# Altium schematic sheet 24-Power-P3V3_P1V8DPLL.SchDoc
size B; SheetNumber: 24; SheetTotal: 25; SPICEModelCacheMBQUAUON: <root> / <DocumentId>MBQUAUON</DocumentId> / <CacheFrame Number="0"> / <Model Name="emk105bj105_v-f" Kind="CKT"> / <Text>* EMK105BJ105_V-F     SPICE MODEL  ( General Type ) / *-------------------------------------------------------------------------------------------------------- / * Model Generated by TAIYO YUDEN Corporation (http://www.ty-top.com) / * Version 1.0 / * TAIYO YUDEN Control No. 170508_130520 / * Copyright(c) 2012 TAIYO YUDEN CO.,LTD. All Rights Reserved. / *-------------------------------------------------------------------------------------------------------- / * / * Products Name : Multilayer Ceramic Capacitors / * / * Characteristics : / *     Capacitance : 1 uF , Rated Voltage : 16V , TCC : X5R / *     Case Size : 1.0 x 0.5 / 0.039 x 0.02 [mm/inch] , Thickness : 0.5 / 0.02 [mm/inch] / *     (Conditions: Temperature = 25 degC , DC Bias Current/Voltage = 0A / 0V) / * / * Frequency Range : 40Hz - 3GHz / * / * External Node Assignments : / * / *  1  o---| |---o  2 / * / *-------------------------------------------------------------------------------------------------------- / .SubCkt EMK105BJ105_V-F 1 2 / **************************** / C0 1 110 0.68309u / Cm 1 101 0.26053u / C1 101 102 0.94076u / Rc1 101 102 1.9029k / C2 102 103 0.66707u / Rc2 102 103 120.36 / C3 103 110 0.57203u / Rc3 103 110 2.1097 / C2m 1 301 0.1871u / C21 301 302 3.2494u / Rc21 301 302 1.1117k / C22 302 303 2.1014u / Rc22 302 303 1.484k / C23 303 304 2.1172u / Rc23 303 304 1.3876k / C24 304 305 0.75729u / Rc24 304 305 332.59 / C25 305 306 0.94401u / Rc25 305 306 249.09 / C26 306 307 0.34674u / Rc26 306 307 28.352 / C27 307 308 0.37158u / Rc27 307 308 19.989 / C28 308 309 0.17933u / Rc28 308 309 31.748 / C29 309 110 0.016445u / Rc29 309 110 1.0592 / Rp0 1 110 100Meg / L0 110 120 0.2216n / Lm 120 130 0.1509n / L1 120 121 0.12659n / RL1 121 130 0.85161 / L2 120 122 0.15996n / RL2 122 130 0.42469 / L3 120 123 7.9543n / RL3 123 130 0.54643m / CR 120 124 0.24334u / LR 124 125 0.090738n / RR 125 130 68.076m / CL 130 140 2.7354p / LL 130 140 0.10762n / RL 130 140 50.614 / Rs 140 2 7.5416m / **************************** / .ends EMK105BJ105_V-F</Text> / </Model> / </CacheFrame> / </root>
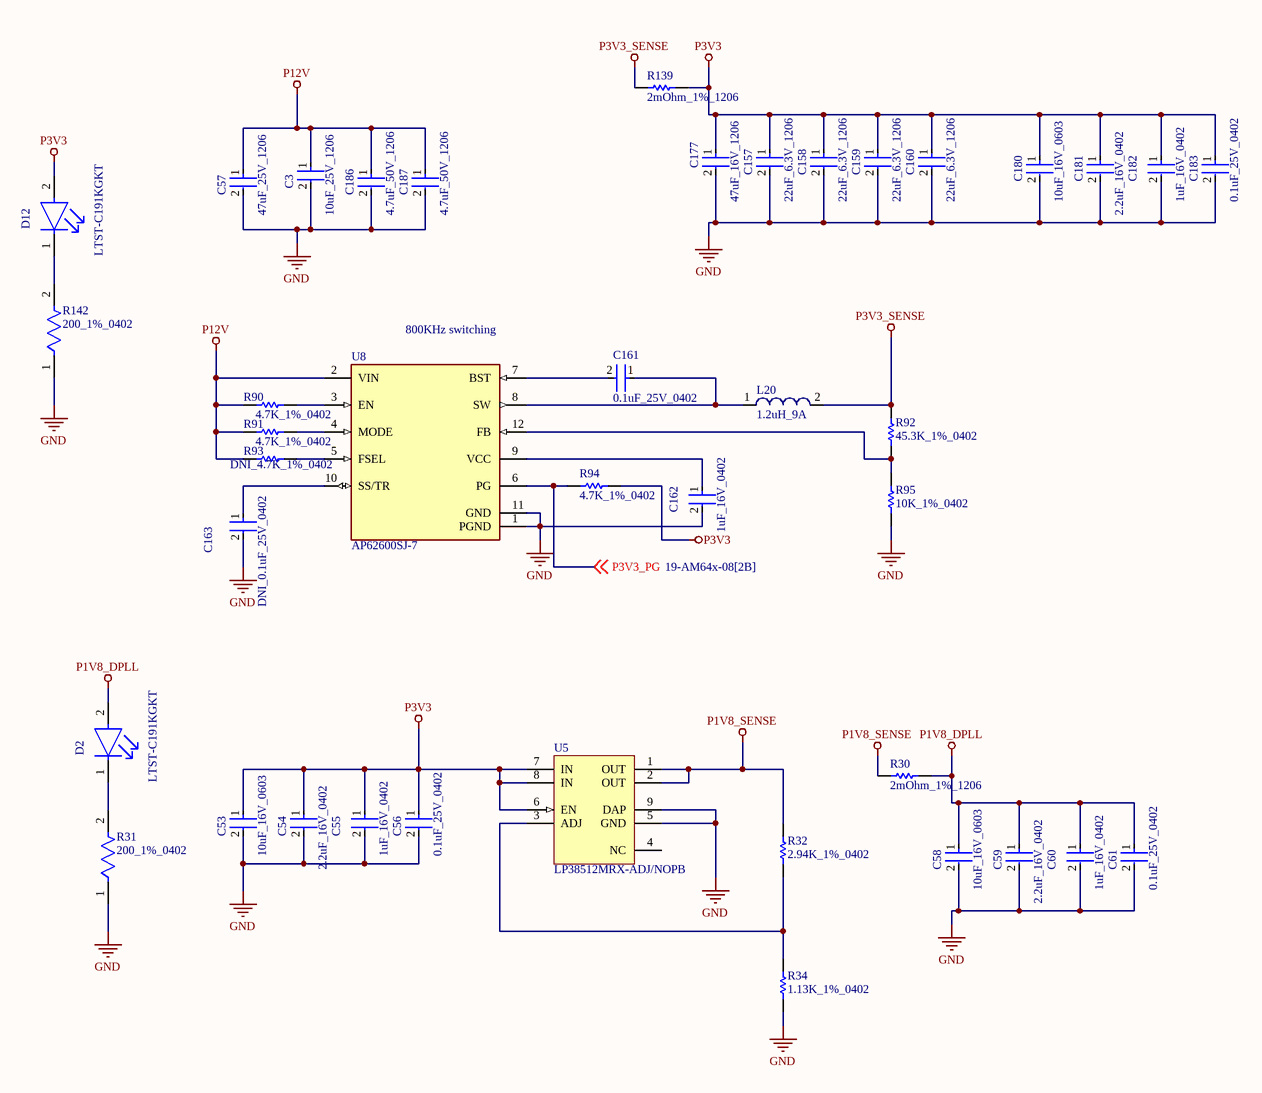
[diagram p0: 24-Power-P3V3_P1V8DPLL.SchDoc]

## Parts
C3  10uF_25V_1206  [FP-1206-L_3_2_0_2-W_1_6_0-IPC_A]
C53  10uF_16V_0603  [FP-0603-L_1_6_0_2-W_0_8_0-MFG]
C54  2.2uF_16V_0402  [FP-C1005-050-0_05-IPC_A]
C55  1uF_16V_0402  [FP-0402-L_1_0_0_05-W_0_5-IPC_A]
C56  0.1uF_25V_0402  [FP-0402-L_1_0_1-W_0_5_0_1-IPC_C]
C57  47uF_25V_1206  [FP-C3216-160-0_2-MFG]
C58  10uF_16V_0603  [FP-0603-L_1_6_0_2-W_0_8_0-MFG]
C59  2.2uF_16V_0402  [FP-C1005-050-0_05-IPC_A]
C60  1uF_16V_0402  [FP-0402-L_1_0_0_05-W_0_5-IPC_A]
C61  0.1uF_25V_0402  [FP-0402-L_1_0_1-W_0_5_0_1-IPC_C]
C157  22uF_6.3V_1206  [FP-1206-L_3_2_0_2-W_1_6_0-IPC_C]
C158  22uF_6.3V_1206  [FP-1206-L_3_2_0_2-W_1_6_0-IPC_C]
C159  22uF_6.3V_1206  [FP-1206-L_3_2_0_2-W_1_6_0-IPC_C]
C160  22uF_6.3V_1206  [FP-1206-L_3_2_0_2-W_1_6_0-IPC_C]
C161  0.1uF_25V_0402  [FP-0402-L_1_0_1-W_0_5_0_1-IPC_C]
C162  1uF_16V_0402  [FP-0402-L_1_0_0_05-W_0_5-IPC_A]
C163  DNI_0.1uF_25V_0402  [FP-0402-L_1_0_1-W_0_5_0_1-IPC_C]  (no BOM)
C177  47uF_16V_1206  [FP-C3216-160-0_2-MFG]
C180  10uF_16V_0603  [FP-0603-L_1_6_0_2-W_0_8_0-MFG]
C181  2.2uF_16V_0402  [FP-C1005-050-0_05-IPC_A]
C182  1uF_16V_0402  [FP-0402-L_1_0_0_05-W_0_5-IPC_A]
C183  0.1uF_25V_0402  [FP-0402-L_1_0_1-W_0_5_0_1-IPC_C]
C186  4.7uF_50V_1206  [FP-GRM31C-0_2-e0_3_0_8-IPC_C]
C187  4.7uF_50V_1206  [FP-GRM31C-0_2-e0_3_0_8-IPC_C]
D2  LTST-C191KGKT  [FP-LTST-C191KGKT-MFG]
D12  LTST-C191KGKT  [FP-LTST-C191KGKT-MFG]
L20  1.2uH_9A  [WE-LHMI 7050]
R30  2mOhm_1%_1206  [RESC3216X89X64NL25T25]
R31  200_1%_0402  [FP-ERJ2RK-IPC_A]
R32  2.94K_1%_0402  [RESC1005X40X25ML05T10]
R34  1.13K_1%_0402  [RESC1005X40X25NL05T05]
R90  4.7K_1%_0402  [RESC1005X40X25NL10T10]
R91  4.7K_1%_0402  [RESC1005X40X25NL10T10]
R92  45.3K_1%_0402  [RESC1005X40X25ML05T10]
R93  DNI_4.7K_1%_0402  [RESC1005X40X25NL10T10]  (no BOM)
R94  4.7K_1%_0402  [RESC1005X40X25NL10T10]
R95  10K_1%_0402  [RESC1005X40X25NL10T10]
R139  2mOhm_1%_1206  [RESC3216X89X64NL25T25]
R142  200_1%_0402  [FP-ERJ2RK-IPC_A]
U5  LP38512MRX-ADJ/NOPB  [MRA08B_M]
U8  AP62600SJ-7  [FP-V-QFN2030-12_Type_A-MFG]

## Nets
GND: C3.2 C53.2 C54.2 C55.2 C56.2 C57.2 C58.2 C59.2 C60.2 C61.2 C157.2 C158.2 C159.2 C160.2 C162.2 C163.2 C177.2 C180.2 C181.2 C182.2 C183.2 C186.2 C187.2 R31.1 R34.1 R95.1 R142.1 U5.5(GND) U5.9(DAP) U8.1(PGND) U8.11(GND)
P1V8_DPLL: C58.1 C59.1 C60.1 C61.1 D2.2(A) R30.2
P1V8_SENSE: R30.1 R32.2 U5.1(OUT) U5.2(OUT)
P3V3: C53.1 C54.1 C55.1 C56.1 C157.1 C158.1 C159.1 C160.1 C177.1 C180.1 C181.1 C182.1 C183.1 D12.2(A) R94.1 R139.2 U5.6(EN) U5.7(IN) U5.8(IN)
P3V3_SENSE: L20.2 R92.2 R139.1
P12V: C3.1 C57.1 C186.1 C187.1 R90.1 R91.1 R93.1 U8.2(VIN)
P3V3_PG: R94.2 U8.6(PG) ; off-sheet P3V3_PG
NetC161_1: C161.1 L20.1 U8.8(SW)
NetC161_2: C161.2 U8.7(BST)
NetC162_1: C162.1 U8.9(VCC)
NetC163_1: C163.1 U8.10(SS/TR)
NetD2_1: D2.1(C) R31.2
NetD12_1: D12.1(C) R142.2
NetR32_1: R32.1 R34.2 U5.3(ADJ)
NetR90_2: R90.2 U8.3(EN)
NetR91_2: R91.2 U8.4(MODE)
NetR92_1: R92.1 R95.2 U8.12(FB)
NetR93_2: R93.2 U8.5(FSEL)

Not connected (* = marked no-connect by the designer): U5 4(NC)

## Notes on the sheet
- (near U8) 800KHz switching

## Library data of the parts
C3 = CMP-04427-006943-1: General Purpose Ceramic Capacitor, 1206, 10uF, 20%, X5R, 15%, 25V; Dissipation Factor: 12.5%; Insulation Resistance: 10GR; Case Code (Imperial): 1206; Series: -; Construction: Flat; Termination: SMD/SMT; Case/Package: 1206; Dielectric: X5R; Width: 1.6mm; Max Operating Temperature: 85°C; Height: 0.07mm; Package Quantity: 1; Depth: 1.6mm; Voltage Rating: 25V; Capacitance: 10uF; RoHS Compliant: Yes; Mount: Surface Mount; Radiation Hardening: No; Voltage Rating (DC): 25V; Number of Pins: 2; Contact Plating: Tin; Min Operating Temperature: -55°C; Lead Free: Lead Free; Packaging: Tape and Reel; Tolerance: 20%; Case Code (Metric): 3216; Thickness: 0.07inch; Length: 3.2mm; REACH SVHC: No SVHC
C53 C58 C180 = CMP-2000-06226-4: Multilayer Ceramic Capacitor 10uF 16V X5R 20% SMD 0603 T/R; Packaging: Tape and Reel; Construction: Flat; Height: 0.8mm; Max Operating Temperature: 85°C; Dielectric: X5R; Case Code (Metric): 1608; Voltage Rating (DC): 16V; Width: 0.031inch; Voltage Rating: 16V; Length: 0.063inch; RoHS Compliant: Yes; Halogen Free: Halogen Free; Case Code (Imperial): 0603; Capacitance: 10uF; Mount: Surface Mount; Thickness: 0.031inch; Tolerance: 20%; Min Operating Temperature: -55°C; Series: M; Termination: SMD/SMT; Case/Package: 0603; Package Quantity: 1
C54 C59 C181 = CMP-2000-05998-2: Multilayer Ceramic Capacitors 2.2μF ±10% 16V X5R SMD 0402; Capacitance: 2.2uF; REACH SVHC: No SVHC; Series: C; Termination: SMD/SMT; Case Code (Imperial): 0402; Depth: 0.5mm; Mount: Surface Mount; Width: 0.02inch; Package Quantity: 1; Dielectric Material: Ceramic; Length: 1mm; Packaging: Tape and Reel; Case Code (Metric): 1005; RoHS Compliant: Yes; Dielectric: X5R; Max Operating Temperature: 85°C; Lead Free: Lead Free; Weight: 2.3E-05oz; Thickness: 0.022inch; Voltage Rating (DC): 16V; Tolerance: 10%; Voltage Rating: 16V; Resistor Type: Ceramic; Height: 0.5mm; Case/Package: 0402; Min Operating Temperature: -55°C
C55 C60 C162 C182 = CMP-14477-000104-2: None; Tolerance: 10%; Voltage Rating: 16V; Dielectric: X5R; Capacitance: 1uF; Packaging: Tape and Reel; Depth: 0.5mm; Mount: Surface Mount; Thickness: 0.022inch; Package Quantity: 1; Min Operating Temperature: -55°C; Series: M; Voltage Rating (DC): 16V; Termination: SMD/SMT; Case/Package: 0402; Number of Pins: 2; Case Code (Imperial): 0402; Length: 1mm; Halogen Free: Halogen Free; Case Code (Metric): 1005; Width: 0.02inch; RoHS Compliant: Yes; Radiation Hardening: No; Max Operating Temperature: 85°C; Height: 0.5mm; Construction: Flat
C56 C61 C161 C163 C183 = CMP-2008-02519-2: General Purpose Ceramic Capacitor, 0402, 100nF, 10%, X7R, 15%, 25V; Package Quantity: 1; Capacitance: 100nF; Min Operating Temperature: -55°C; Voltage: 25V; Voltage Rating: 25V; Construction: Flat; Max Operating Temperature: 125°C; Radiation Hardening: No; Depth: 0.5mm; Thickness: 0.022inch; Voltage Rating (DC): 25V; Number of Pins: 2; Lead Free: Lead Free; Series: -; REACH SVHC: No SVHC; Length: 1mm; Dielectric: X7R; RoHS Compliant: Yes; Mount: Surface Mount; Packaging: Tape and Reel; Case/Package: 0402; Case Code (Imperial): 0402; Termination: SMD/SMT; Width: 0.02inch; Case Code (Metric): 1005; Tolerance: 10%
C57 = CMP-2000-05397-3: Multilayer Ceramic Capacitors 47uF ±20% 25V X5R SMD 1206; Weight: 0.000571oz; Dielectric: X5R; Length: 0.126inch; Voltage Rating: 25V; Case/Package: 1206; Dielectric Material: Ceramic; Min Operating Temperature: -55°C; Lead Free: Lead Free; Packaging: Tape and Reel; Package Quantity: 1; Mount: Surface Mount; Depth: 1.6mm; REACH SVHC: No SVHC; Termination: SMD/SMT; Case Code (Imperial): 1206; Series: C; Resistor Type: Ceramic; Voltage: 25V; Width: 0.063inch; Height: 1.6mm; Tolerance: 20%; Capacitance: 47uF; Max Operating Temperature: 85°C; Voltage Rating (DC): 25V; RoHS Compliant: Yes; Thickness: 0.071inch; Case Code (Metric): 3216
C157-C160 = CMP-2000-05869-2: General Purpose Ceramic Capacitor, 1206, 22uF, 20%, X5R, 15%, 6.3V; Lead Free: Lead Free; Case Code (Metric): 3216; Case/Package: 1206; Depth: 1.6mm; Capacitance: 22uF; Length: 3.2mm; Series: -; Contact Plating: Tin; Tolerance: 20%; REACH SVHC: No SVHC; Radiation Hardening: No; RoHS Compliant: Yes; Termination: SMD/SMT; Voltage Rating: 6.3V; Packaging: Tape and Reel; Voltage: 6.3V; Mount: Surface Mount; Thickness: 0.07inch; Package Quantity: 1; Voltage Rating (DC): 6.3V; Case Code (Imperial): 1206; Construction: Flat; Dielectric: X5R; Number of Pins: 2; Min Operating Temperature: -55°C; Height: 0.07mm; Width: 0.063inch; Max Operating Temperature: 85°C
C177 = CMP-2000-07442-2: Multilayer Ceramic Capacitors 47uF ±20% 16V X5R SMD 1206; Resistor Type: Ceramic; Width: 0.063inch; Case Code (Imperial): 1206; Radiation Hardening: No; Thickness: 0.071inch; Dielectric: X5R; Weight: 0.000571oz; Termination: SMD/SMT; Dielectric Material: Ceramic; Min Operating Temperature: -55°C; Depth: 1.6mm; Case Code (Metric): 3216; Max Operating Temperature: 85°C; RoHS Compliant: Yes; REACH SVHC: No SVHC; Mount: Surface Mount; Lead Free: Lead Free; Height: 1.6mm; Length: 3.2mm; Tolerance: 20%; Voltage Rating (DC): 16V; Capacitance: 47uF; Package Quantity: 1; Construction: Flat; Packaging: Tape and Reel; Series: C; Case/Package: 1206; Voltage Rating: 16V
C186 C187 = CMP-1037-04923-3: Chip Multilayer Ceramic Capacitors for General Purpose, 1206, 4.7uF, X7R, 15%, 10%, 50V; Height: 1.6mm; Voltage: 50V; Capacitance: 4.7uF; Lead Free: Lead Free; Max Operating Temperature: 125°C; Packaging: Tape and Reel; REACH SVHC: No SVHC; Voltage Rating: 50V; Mount: Surface Mount; Termination: SMD/SMT; Tolerance: 10%; Case/Package: 1206; Material: Ceramic; Depth: 1.6mm; Length: 3.2mm; Case Code (Metric): 3216; Voltage Rating (DC): 50V; Case Code (Imperial): 1206; Radiation Hardening: No; Width: 0.063inch; Thickness: 0.071inch; Package Quantity: 2000; Min Operating Temperature: -55°C; Dielectric: X7R
D2 D12 = CMP-2000-05198-2: LED GREEN CLEAR SMD; Max Power Dissipation: 75mW; Forward Current: 30mA; Reverse Voltage: 5V; Lens Color: Colorless; Forward Voltage: 2V; Dominant Wavelength: 571nm; Number of LEDs: 1; Viewing Angle: 130°; Lens Style: Rectangular; Test Current: 20mA; Luminous Intensity: 35mcd; Wavelength: 574nm; Width: 0.8mm; Case Code (Imperial): 0603; Number of Pins: 2; Lead Free: Lead Free; Packaging: Tape and Reel; Package Quantity: 1; Min Operating Temperature: -55°C; Case/Package: 0603; Length: 1.6mm; Power Dissipation: 75mW; Depth: 0.8mm; Radiation Hardening: No; Mount: Surface Mount; Max Operating Temperature: 85°C; Color: Green; Power Rating: 75mW; Height: 0.55mm; Illumination Color: Green; Case Code (Metric): 1608; Lens Transparency: Clear; Number of Elements: 1
L20 = CMP-1353-00066-2: SMD Power Inductor WE-LHMI, L=1.2 µH; Manufacturer: Wuerth Elektronik; PartNumber: 74437349012; Inductance: 1.2 ÂµH; ComponentLink1Description: Manufacturer URL; ComponentLink2URL: http://katalog.we-online.de/kataloge/eisos/media/pdf/74437349012.pdf; ComponentLink1URL: http://www.we-online.com; PackageReference: WE-LHMI 7050; ComponentLink2Description: Datasheet
R30 R139 = CMP-2003-04334-1: Manufacturer: Vishay Dale; Part Number: WSL12062L000FEA18
R31 R142 = CMP-2002-00757-2: RES SMD 200 OHM 1% 1/10W 0402; Power Rating: 100mW; Voltage Rating (DC): 50V; Resistance: 200R; Temperature Coefficient: 100ppm/°C; RoHS Compliant: Yes; Packaging: Tape and Reel; Case Code (Metric): 1005; Package Quantity: 1; Contact Plating: Tin; Series: ERJ; Mount: Surface Mount; Lead Free: Lead Free; Min Operating Temperature: -55°C; Number of Terminations: 2; Max Power Dissipation: 100mW; Technology: THICK FILM; Voltage Rating: 50V; Case/Package: 0402; Width: 0.02inch; Termination: SMD/SMT; Military Standard: Not; Height: 0.35mm; Radiation Hardening: No; Resistance Tolerance: 1%; Length: 1mm; REACH SVHC: No SVHC; Construction: Rectangular; Depth: 0.5mm; Features: Automotive AEC-Q200; Resistor Type: Thick Film; Case Code (Imperial): 0402; Tolerance: 1%; Size Code: 0402; Max Operating Temperature: 155°C
R32 = CMP-2002-07579-1: Manufacturer: Yageo; Part Number: RC0402FR-072K94L
R34 = CMP-2002-00630-1: Manufacturer: Panasonic; Part Number: ERJ-2RKF1131X
R90 R91 R93 R94 = CMP-2002-05217-1: Manufacturer: Bourns; Part Number: CR0402-FX-4701GLF
R92 = CMP-2002-07692-1: Part Number: RC0402FR-0745K3L; Manufacturer: Yageo / Phycomp
R95 = CMP-2002-04694-1: Manufacturer: Bourns; Part Number: CR0402-FX-1002GLF
U5 = CMP-0062-01039-2: 1.5A Fast-Transient Response Adjustable Low-Dropout Linear Voltage Regulator, 8-pin PSOP, Pb-Free; Manufacturer: National Semiconductor; CompType: LDO IC; PackageTopMarking: NSXYTT*L38512*-ADJ; PowerWise: N; ComponentLink3URL: http://www.national.com/packaging/folders/mra08b.html; PackageReference: MRA08B; RoHS: Y; DatasheetVersion: Feb-2009; ComponentLink2Description: LP38512 Web Page; PackageDescription: Molded, PSOP .193 x .154 x .058in, 8 Lead, .050in Pitch, Large DAP; ComponentLink1URL: http://www.national.com/ds/LP/LP38512-ADJ.pdf; ComponentLink3Description: MRA08B Package Page; ComponentLink1Description: LP38512 Datasheet; PackageVersion: revB, Dec-2007; ComponentLink2URL: http://www.national.com/pf/LP/LP38512.html; Code_JEDEC: MS-012-AA; PinCount: 8; RevisionNote: Component URLs added
U8 = CMP-12757-000022-1: DCDC CONV HV BUCK,V-QFN2030-12; RoHS Compliant: Yes